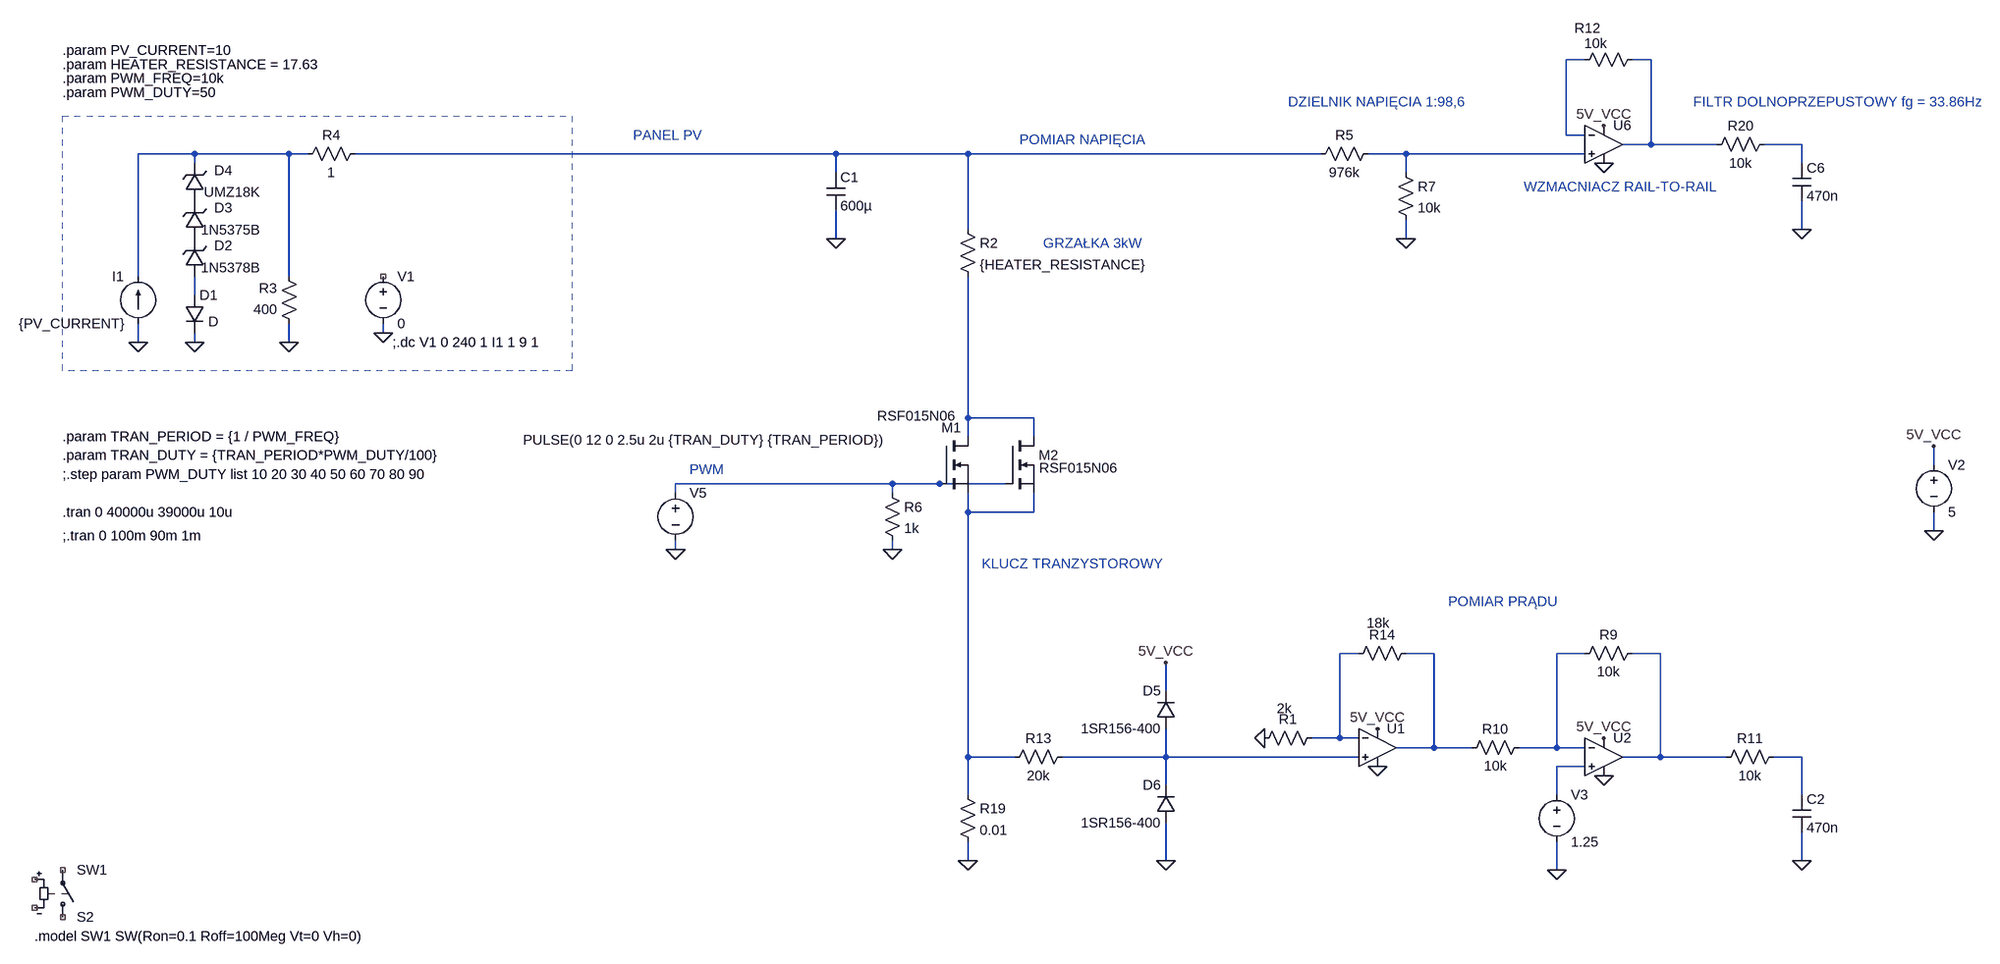
[diagram p0: schematic PWM MPPT.asc]
PWM MPPT.asc, the LTspice schematic file:
Version 4
SHEET 1 4840 960
WIRE 1632 -544 1600 -544
WIRE 1744 -544 1712 -544
WIRE 1600 -416 1600 -544
WIRE 1632 -416 1600 -416
WIRE 1744 -400 1744 -544
WIRE 1744 -400 1696 -400
WIRE 1856 -400 1744 -400
WIRE 2000 -400 1936 -400
WIRE -784 -384 -880 -384
WIRE -624 -384 -784 -384
WIRE -592 -384 -624 -384
WIRE 304 -384 -512 -384
WIRE 528 -384 304 -384
WIRE 1184 -384 528 -384
WIRE 1328 -384 1264 -384
WIRE 1632 -384 1328 -384
WIRE -784 -368 -784 -384
WIRE 2000 -368 2000 -400
WIRE 304 -352 304 -384
WIRE 1328 -352 1328 -384
WIRE 528 -256 528 -384
WIRE 2000 -256 2000 -304
WIRE 304 -240 304 -288
WIRE 1328 -240 1328 -272
WIRE -880 -176 -880 -384
WIRE -624 -176 -624 -384
WIRE -784 -144 -784 -176
WIRE -464 -80 -464 -96
WIRE -880 -64 -880 -96
WIRE -784 -64 -784 -80
WIRE -624 -64 -624 -96
WIRE 528 64 528 -176
WIRE 640 64 528 64
WIRE 528 96 528 64
WIRE 640 96 640 64
WIRE 2224 144 2224 112
WIRE 400 176 32 176
WIRE 480 176 400 176
WIRE 592 176 480 176
WIRE 32 192 32 176
WIRE 400 192 400 176
WIRE 528 224 528 192
WIRE 640 224 640 192
WIRE 640 224 528 224
WIRE 2224 256 2224 224
WIRE 32 288 32 272
WIRE 400 288 400 272
WIRE 1248 464 1216 464
WIRE 1376 464 1328 464
WIRE 1632 464 1584 464
WIRE 1760 464 1712 464
WIRE 864 528 864 480
WIRE 1216 608 1216 464
WIRE 1216 608 1168 608
WIRE 1248 608 1216 608
WIRE 1376 624 1376 464
WIRE 1376 624 1312 624
WIRE 1440 624 1376 624
WIRE 1584 624 1584 464
WIRE 1584 624 1520 624
WIRE 1632 624 1584 624
WIRE 528 640 528 224
WIRE 608 640 528 640
WIRE 864 640 864 592
WIRE 864 640 688 640
WIRE 1248 640 864 640
WIRE 1760 640 1760 464
WIRE 1760 640 1696 640
WIRE 1872 640 1760 640
WIRE 2000 640 1952 640
WIRE 1632 656 1584 656
WIRE 864 688 864 640
WIRE 528 704 528 640
WIRE 1584 704 1584 656
WIRE 2000 704 2000 640
WIRE 528 816 528 784
WIRE 864 816 864 752
WIRE 2000 816 2000 768
WIRE 1584 832 1584 784
FLAG -784 -64 0
FLAG 528 816 0
FLAG 32 288 0
FLAG 304 -240 0
FLAG -880 -64 0
FLAG -624 -64 0
FLAG -464 -80 0
FLAG 400 288 0
FLAG 1328 -240 0
FLAG 2224 256 0
FLAG 2224 112 5V_VCC
FLAG 1664 -368 0
FLAG 1664 -432 5V_VCC
FLAG 2000 -256 0
FLAG 1280 592 5V_VCC
FLAG 1664 608 5V_VCC
FLAG 1280 656 0
FLAG 1088 608 0
FLAG 1584 832 0
FLAG 2000 816 0
FLAG 1664 672 0
FLAG 864 816 0
FLAG 864 480 5V_VCC
SYMBOL sw -1008 928 M180
SYMATTR InstName S2
SYMATTR Value SW1
SYMBOL voltage 32 176 R0
WINDOW 123 0 0 Left 2
WINDOW 39 0 0 Left 2
WINDOW 3 -259 -74 Left 2
SYMATTR Value PULSE(0 12 0 2.5u 2u {TRAN_DUTY} {TRAN_PERIOD})
SYMATTR InstName V5
SYMBOL res 512 -272 R0
SYMATTR InstName R2
SYMATTR Value {HEATER_RESISTANCE}
SYMBOL cap 288 -352 R0
SYMATTR InstName C1
SYMATTR Value 600µ
SYMBOL current -880 -96 R180
WINDOW 0 24 80 Left 2
WINDOW 3 24 0 Left 2
WINDOW 123 0 0 Left 2
WINDOW 39 0 0 Left 2
SYMATTR InstName I1
SYMATTR Value {PV_CURRENT}
SYMBOL res -608 -80 R180
WINDOW 0 36 76 Left 2
WINDOW 3 36 40 Left 2
SYMATTR InstName R3
SYMATTR Value 400
SYMBOL res -608 -368 R270
WINDOW 0 32 56 VTop 2
WINDOW 3 0 56 VBottom 2
SYMATTR InstName R4
SYMATTR Value 1
SYMBOL diode -800 -144 R0
WINDOW 3 39 45 Left 2
SYMATTR InstName D1
SYMBOL zener -768 -176 R180
WINDOW 0 -48 52 Left 2
WINDOW 3 -95 15 Left 2
SYMATTR InstName D2
SYMATTR Value 1N5378B
SYMATTR Description Diode
SYMATTR Type diode
SYMBOL zener -768 -240 R180
WINDOW 0 -48 52 Left 2
WINDOW 3 -95 15 Left 2
SYMATTR InstName D3
SYMATTR Value 1N5375B
SYMATTR Description Diode
SYMATTR Type diode
SYMBOL zener -768 -304 R180
WINDOW 0 -48 52 Left 2
WINDOW 3 -95 15 Left 2
SYMATTR InstName D4
SYMATTR Value UMZ18K
SYMATTR Description Diode
SYMATTR Type diode
SYMBOL res 1280 -400 R90
WINDOW 0 0 56 VBottom 2
WINDOW 3 32 56 VTop 2
SYMATTR InstName R5
SYMATTR Value 976k
SYMBOL voltage -464 -192 R0
WINDOW 123 0 0 Left 0
WINDOW 39 0 0 Left 0
SYMATTR InstName V1
SYMATTR Value 0
SYMBOL nmos 480 96 R0
WINDOW 0 3 -15 Left 2
WINDOW 3 -106 -35 Left 2
SYMATTR InstName M1
SYMATTR Value RSF015N06
SYMBOL res 384 176 R0
SYMATTR InstName R6
SYMATTR Value 1k
SYMBOL nmos 592 96 R0
WINDOW 3 57 53 Left 2
SYMATTR Value RSF015N06
SYMATTR InstName M2
SYMBOL res 1312 -368 R0
SYMATTR InstName R7
SYMATTR Value 10k
SYMBOL voltage 2224 128 R0
WINDOW 123 0 0 Left 0
WINDOW 39 0 0 Left 0
SYMATTR InstName V2
SYMATTR Value 5
SYMBOL res 1728 -560 R90
WINDOW 0 -22 92 VBottom 2
WINDOW 3 -27 78 VTop 2
SYMATTR InstName R12
SYMATTR Value 10k
SYMBOL res 1952 -416 R90
WINDOW 0 0 56 VBottom 2
WINDOW 3 32 56 VTop 2
SYMATTR InstName R20
SYMATTR Value 10k
SYMBOL cap 1984 -368 R0
SYMATTR InstName C6
SYMATTR Value 470n
SYMBOL res 512 688 R0
SYMATTR InstName R19
SYMATTR Value 0.01
SYMATTR SpiceLine tol=1
SYMBOL OpAmps\\UniversalOpamp 1664 -400 R0
SYMATTR InstName U6
SYMBOL OpAmps\\UniversalOpamp 1280 624 R0
SYMATTR InstName U1
SYMBOL OpAmps\\UniversalOpamp 1664 640 R0
SYMATTR InstName U2
SYMBOL res 1184 592 R90
WINDOW 0 0 56 VBottom 2
WINDOW 3 -50 62 VTop 2
SYMATTR InstName R1
SYMATTR Value 2k
SYMATTR SpiceLine tol=1
SYMBOL res 1344 448 R90
WINDOW 0 0 56 VBottom 2
WINDOW 3 -51 63 VTop 2
SYMATTR InstName R14
SYMATTR Value 18k
SYMATTR SpiceLine tol=1
SYMBOL res 1728 448 R90
WINDOW 0 0 56 VBottom 2
WINDOW 3 32 56 VTop 2
SYMATTR InstName R9
SYMATTR Value 10k
SYMATTR SpiceLine tol=1
SYMBOL res 1536 608 R90
WINDOW 0 0 56 VBottom 2
WINDOW 3 32 56 VTop 2
SYMATTR InstName R10
SYMATTR Value 10k
SYMATTR SpiceLine tol=1
SYMBOL voltage 1584 688 R0
WINDOW 123 0 0 Left 0
WINDOW 39 0 0 Left 0
SYMATTR InstName V3
SYMATTR Value 1.25
SYMBOL res 1968 624 R90
WINDOW 0 0 56 VBottom 2
WINDOW 3 32 56 VTop 2
SYMATTR InstName R11
SYMATTR Value 10k
SYMBOL cap 1984 704 R0
SYMATTR InstName C2
SYMATTR Value 470n
SYMBOL res 704 624 R90
WINDOW 0 0 56 VBottom 2
WINDOW 3 32 56 VTop 2
SYMATTR InstName R13
SYMATTR Value 20k
SYMBOL diode 880 592 R180
WINDOW 0 24 64 Left 2
WINDOW 3 24 0 Left 2
SYMATTR InstName D5
SYMATTR Value 1SR156-400
SYMBOL diode 880 752 R180
WINDOW 0 24 64 Left 2
WINDOW 3 24 0 Left 2
SYMATTR InstName D6
SYMATTR Value 1SR156-400
TEXT -1008 224 Left 2 !.tran 0 40000u 39000u 10u
TEXT -1056 944 Left 2 !.model SW1 SW(Ron=0.1 Roff=100Meg Vt=0 Vh=0)
TEXT -448 -64 Left 2 !;.dc V1 0 240 1 I1 1 9 1
TEXT -40 -416 Left 2 ;PANEL PV
TEXT 656 -232 Left 2 ;GRZAŁKA 3kW
TEXT -1008 -560 Left 2 !.param PV_CURRENT=10
TEXT -1008 -512 Left 2 !.param PWM_FREQ=10k
TEXT -1008 -536 Left 2 !.param HEATER_RESISTANCE = 17.63
TEXT -1008 96 Left 2 !.param TRAN_PERIOD = {1 / PWM_FREQ}
TEXT -1008 -488 Left 2 !.param PWM_DUTY=50
TEXT -1008 128 Left 2 !.param TRAN_DUTY = {TRAN_PERIOD*PWM_DUTY/100}
TEXT -1008 160 Left 2 !;.step param PWM_DUTY list 10 20 30 40 50 60 70 80 90
TEXT 1128 -472 Left 2 ;DZIELNIK NAPIĘCIA 1:98,6
TEXT 1528 -328 Left 2 ;WZMACNIACZ RAIL-TO-RAIL
TEXT 1816 -472 Left 2 ;FILTR DOLNOPRZEPUSTOWY fg = 33.86Hz
TEXT -1008 264 Left 2 !;.tran 0 100m 90m 1m
TEXT 56 152 Left 2 ;PWM
TEXT 616 -408 Left 2 ;POMIAR NAPIĘCIA
TEXT 1400 376 Left 2 ;POMIAR PRĄDU
TEXT 552 312 Left 2 ;KLUCZ TRANZYSTOROWY
RECTANGLE Normal -144 -16 -1008 -448 2

The netlist it stands for:
* PWM MPPT.asc
S2 NC_01 NC_02 NC_03 NC_04 SW1
V5 N009 0 PULSE(0 12 0 2.5u 2u {TRAN_DUTY} {TRAN_PERIOD})
R2 N005 N008 {HEATER_RESISTANCE}
C1 N005 0 600µ
I1 0 N004 {PV_CURRENT}
R3 0 N004 400
R4 N004 N005 1
D1 N007 0 D
D2 N007 P001 1N5378B
D3 P001 P002 1N5375B
D4 P002 N004 UMZ18K
R5 N006 N005 976k
V1 NC_05 0 0
M1 N008 N009 N010 N010 RSF015N06
R6 N009 0 1k
M2 N008 N009 N010 N010 RSF015N06
R7 N006 0 10k
V2 5V_VCC 0 5
R12 N002 N001 10k
R20 N003 N002 10k
C6 N003 0 470n
R19 N010 0 0.01 tol=1
XU6 N006 N001 5V_VCC 0 N002 level1 Avol=1Meg GBW=10Meg Vos=0 En=0 Enk=0 In=0 Ink=0 Rin=500Meg  ; pins In+ In- V+ V- OUT
XU1 N015 N011 5V_VCC 0 N012 level1 Avol=1Meg GBW=10Meg Vos=0 En=0 Enk=0 In=0 Ink=0 Rin=500Meg  ; pins In+ In- V+ V- OUT
XU2 N017 N013 5V_VCC 0 N014 level1 Avol=1Meg GBW=10Meg Vos=0 En=0 Enk=0 In=0 Ink=0 Rin=500Meg  ; pins In+ In- V+ V- OUT
R1 N011 0 2k tol=1
R14 N012 N011 18k tol=1
R9 N014 N013 10k tol=1
R10 N013 N012 10k tol=1
V3 N017 0 1.25
R11 N016 N014 10k
C2 N016 0 470n
R13 N015 N010 20k
D5 N015 5V_VCC 1SR156-400
D6 0 N015 1SR156-400
.model D D
.lib standard.dio
.model NMOS NMOS
.model PMOS PMOS
.lib standard.mos
.tran 0 40000u 39000u 10u
.model SW1 SW(Ron=0.1 Roff=100Meg Vt=0 Vh=0)
;.dc V1 0 240 1 I1 1 9 1
* PANEL PV
* GRZAŁKA 3kW
.param PV_CURRENT=10
.param PWM_FREQ=10k
.param HEATER_RESISTANCE = 17.63
.param TRAN_PERIOD = {1 / PWM_FREQ}
.param PWM_DUTY=50
.param TRAN_DUTY = {TRAN_PERIOD*PWM_DUTY/100}
;.step param PWM_DUTY list 10 20 30 40 50 60 70 80 90
* DZIELNIK NAPIĘCIA 1:98,6
* WZMACNIACZ RAIL-TO-RAIL
* FILTR DOLNOPRZEPUSTOWY fg = 33.86Hz
;.tran 0 100m 90m 1m
* PWM
* POMIAR NAPIĘCIA
* POMIAR PRĄDU
* KLUCZ TRANZYSTOROWY
.lib UniversalOpAmp1.lib
.backanno
.end